# Altium project mdriver2_control.PrjPcb (part 1 of 2)
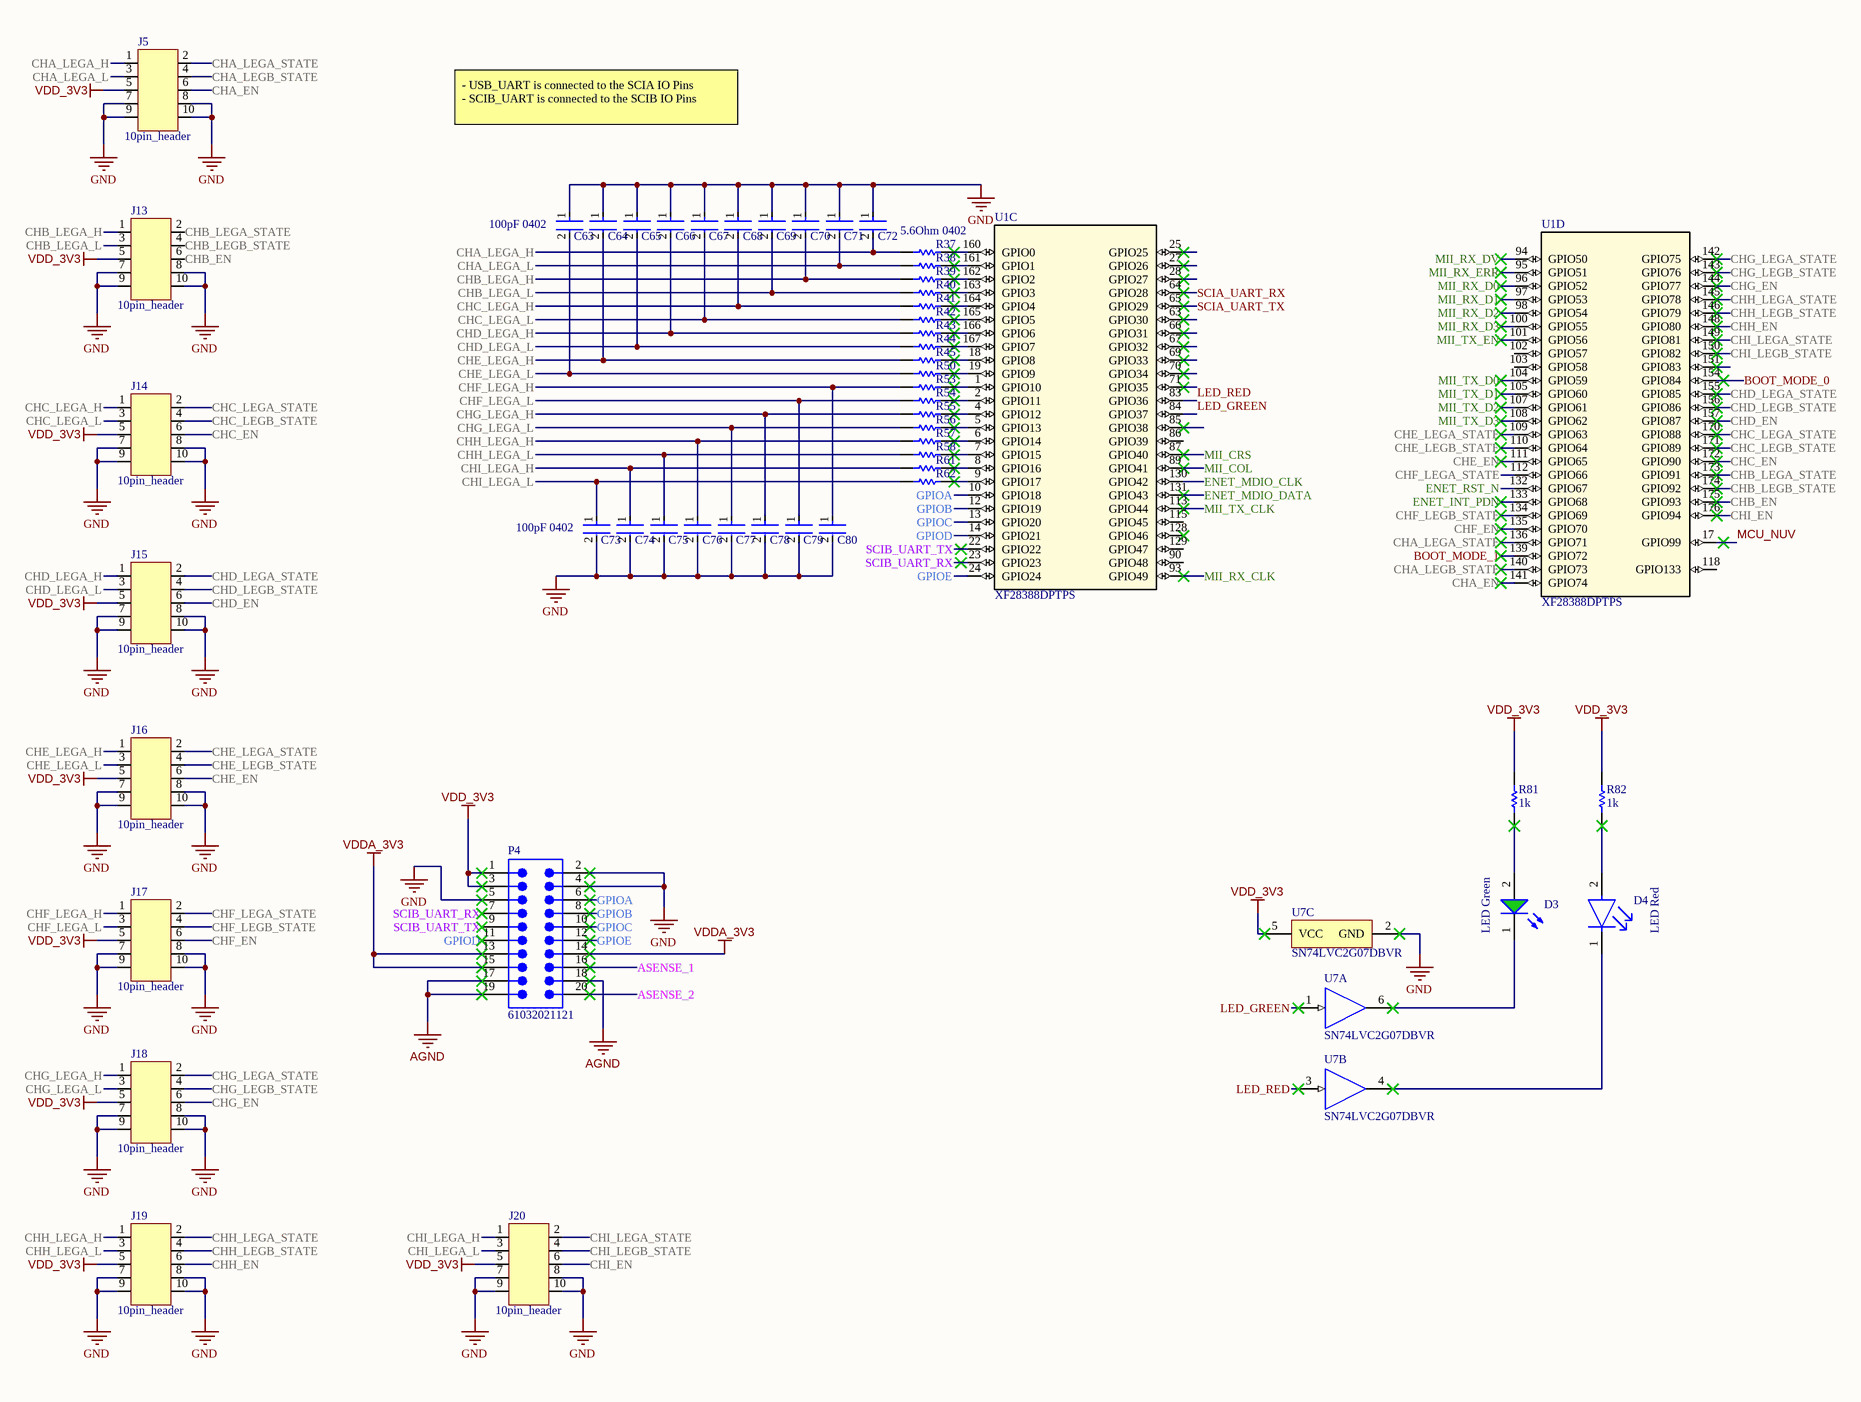
[diagram p0: mcu.SchDoc, right]
6 sheets, 263 parts. Net scope: global (net labels, ports and power ports of the same name join across sheets).
Board file: mdriver2_control.PcbDoc
Sheets:
  mcu.SchDoc
  power.SchDoc
  auxiliary.SchDoc
  usb.SchDoc
  analog.SchDoc
  ethernet.SchDoc

## Sheet mcu.SchDoc
size A3; SheetNumber: 1; SheetTotal: 6

### Parts
C63  100pF 0402  [FP-0402-L_1_0_1-W_0_5_0_1-MFG]
C64  100pF 0402  [FP-0402-L_1_0_1-W_0_5_0_1-MFG]  (value not drawn)
C65  100pF 0402  [FP-0402-L_1_0_1-W_0_5_0_1-MFG]  (value not drawn)
C66  100pF 0402  [FP-0402-L_1_0_1-W_0_5_0_1-MFG]  (value not drawn)
C67  100pF 0402  [FP-0402-L_1_0_1-W_0_5_0_1-MFG]  (value not drawn)
C68  100pF 0402  [FP-0402-L_1_0_1-W_0_5_0_1-MFG]  (value not drawn)
C69  100pF 0402  [FP-0402-L_1_0_1-W_0_5_0_1-MFG]  (value not drawn)
C70  100pF 0402  [FP-0402-L_1_0_1-W_0_5_0_1-MFG]  (value not drawn)
C71  100pF 0402  [FP-0402-L_1_0_1-W_0_5_0_1-MFG]  (value not drawn)
C72  100pF 0402  [FP-0402-L_1_0_1-W_0_5_0_1-MFG]  (value not drawn)
C73  100pF 0402  [FP-0402-L_1_0_1-W_0_5_0_1-MFG]
C74  100pF 0402  [FP-0402-L_1_0_1-W_0_5_0_1-MFG]  (value not drawn)
C75  100pF 0402  [FP-0402-L_1_0_1-W_0_5_0_1-MFG]  (value not drawn)
C76  100pF 0402  [FP-0402-L_1_0_1-W_0_5_0_1-MFG]  (value not drawn)
C77  100pF 0402  [FP-0402-L_1_0_1-W_0_5_0_1-MFG]  (value not drawn)
C78  100pF 0402  [FP-0402-L_1_0_1-W_0_5_0_1-MFG]  (value not drawn)
C79  100pF 0402  [FP-0402-L_1_0_1-W_0_5_0_1-MFG]  (value not drawn)
C80  100pF 0402  [FP-0402-L_1_0_1-W_0_5_0_1-MFG]  (value not drawn)
D3  LED Green  [WL-SMCD_0603]
D4  LED Red  [FP-6_541-5092_01-4-MFG]
J5  10pin_header  [header_10]
J13  10pin_header  [header_10]
J14  10pin_header  [header_10]
J15  10pin_header  [header_10]
J16  10pin_header  [header_10]
J17  10pin_header  [header_10]
J18  10pin_header  [header_10]
J19  10pin_header  [header_10]
J20  10pin_header  [header_10]
P4  61032021121  [61032021121]
R37  5.6Ohm 0402  [RESC1005X40X25NL05T10]
R38  5.6Ohm 0402  [RESC1005X40X25NL05T10]  (value not drawn)
R39  5.6Ohm 0402  [RESC1005X40X25NL05T10]  (value not drawn)
R40  5.6Ohm 0402  [RESC1005X40X25NL05T10]  (value not drawn)
R41  5.6Ohm 0402  [RESC1005X40X25NL05T10]  (value not drawn)
R42  5.6Ohm 0402  [RESC1005X40X25NL05T10]  (value not drawn)
R43  5.6Ohm 0402  [RESC1005X40X25NL05T10]  (value not drawn)
R44  5.6Ohm 0402  [RESC1005X40X25NL05T10]  (value not drawn)
R45  5.6Ohm 0402  [RESC1005X40X25NL05T10]  (value not drawn)
R50  5.6Ohm 0402  [RESC1005X40X25NL05T10]  (value not drawn)
R53  5.6Ohm 0402  [RESC1005X40X25NL05T10]  (value not drawn)
R54  5.6Ohm 0402  [RESC1005X40X25NL05T10]  (value not drawn)
R55  5.6Ohm 0402  [RESC1005X40X25NL05T10]  (value not drawn)
R56  5.6Ohm 0402  [RESC1005X40X25NL05T10]  (value not drawn)
R57  5.6Ohm 0402  [RESC1005X40X25NL05T10]  (value not drawn)
R58  5.6Ohm 0402  [RESC1005X40X25NL05T10]  (value not drawn)
R61  5.6Ohm 0402  [RESC1005X40X25NL05T10]  (value not drawn)
R62  5.6Ohm 0402  [RESC1005X40X25NL05T10]  (value not drawn)
R81  1k  [RES 0402_1005]
R82  1k  [RES 0402_1005]
U1  XF28388DPTPS  [PTP0176F-IPC_A]  (parts C,D of 5)
U7  SN74LVC2G07DBVR  [DBV0006A_M]  (parts A,B,C of 3)

### Nets
AGND: C63.1 C64.1 C65.1 C66.1 C67.1 C68.1 C69.1 C70.1 C71.1 C72.1 C73.2 C74.2 C75.2 C76.2 C77.2 C78.2 C79.2 C80.2 J5.7 J5.8 J5.9 J5.10 J13.7 J13.8 J13.9 J13.10 J14.7 J14.8 J14.9 J14.10 J15.7 J15.8 J15.9 J15.10 J16.7 J16.8 J16.9 J16.10 J17.7 J17.8 J17.9 J17.10 J18.7 J18.8 J18.9 J18.10 J19.7 J19.8 J19.9 J19.10 J20.7 J20.8 J20.9 J20.10 P4.2 P4.4 P4.5 P4.17 P4.18 P4.19 U7.2(GND)  [also labelled GND]
VDD_3V3: J5.5 J13.5 J14.5 J15.5 J16.5 J17.5 J18.5 J19.5 J20.5 P4.1 P4.3 R81.1 R82.1 U7.5(VCC)
VDDA_3V3: P4.13 P4.14 P4.15
ASENSE_1: P4.16
ASENSE_2: P4.20
BOOT_MODE_0: U1.154(GPIO84)
BOOT_MODE_1: U1.139(GPIO72)
CHA_EN: J5.6 U1.141(GPIO74)
CHA_LEGA_H: C72.2 J5.1 R37.1
CHA_LEGA_L: C71.2 J5.3 R38.1
CHA_LEGA_STATE: J5.2 U1.136(GPIO71)
CHA_LEGB_STATE: J5.4 U1.140(GPIO73)
CHB_EN: J13.6 U1.175(GPIO93)
CHB_LEGA_H: C70.2 J13.1 R39.1
CHB_LEGA_L: C69.2 J13.3 R40.1
CHB_LEGA_STATE: J13.2 U1.173(GPIO91)
CHB_LEGB_STATE: J13.4 U1.174(GPIO92)
CHC_EN: J14.6 U1.172(GPIO90)
CHC_LEGA_H: C68.2 J14.1 R41.1
CHC_LEGA_L: C67.2 J14.3 R42.1
CHC_LEGA_STATE: J14.2 U1.170(GPIO88)
CHC_LEGB_STATE: J14.4 U1.171(GPIO89)
CHD_EN: J15.6 U1.157(GPIO87)
CHD_LEGA_H: C66.2 J15.1 R43.1
CHD_LEGA_L: C65.2 J15.3 R44.1
CHD_LEGA_STATE: J15.2 U1.155(GPIO85)
CHD_LEGB_STATE: J15.4 U1.156(GPIO86)
CHE_EN: J16.6 U1.111(GPIO65)
CHE_LEGA_H: C64.2 J16.1 R45.1
CHE_LEGA_L: C63.2 J16.3 R50.1
CHE_LEGA_STATE: J16.2 U1.109(GPIO63)
CHE_LEGB_STATE: J16.4 U1.110(GPIO64)
CHF_EN: J17.6 U1.135(GPIO70)
CHF_LEGA_H: C80.1 J17.1 R53.1
CHF_LEGA_L: C79.1 J17.3 R54.1
CHF_LEGA_STATE: J17.2 U1.112(GPIO66)
CHF_LEGB_STATE: J17.4 U1.134(GPIO69)
CHG_EN: J18.6 U1.144(GPIO77)
CHG_LEGA_H: C78.1 J18.1 R55.1
CHG_LEGA_L: C77.1 J18.3 R56.1
CHG_LEGA_STATE: J18.2 U1.142(GPIO75)
CHG_LEGB_STATE: J18.4 U1.143(GPIO76)
CHH_EN: J19.6 U1.148(GPIO80)
CHH_LEGA_H: C76.1 J19.1 R57.1
CHH_LEGA_L: C75.1 J19.3 R58.1
CHH_LEGA_STATE: J19.2 U1.145(GPIO78)
CHH_LEGB_STATE: J19.4 U1.146(GPIO79)
CHI_EN: J20.6 U1.176(GPIO94)
CHI_LEGA_H: C74.1 J20.1 R61.1
CHI_LEGA_L: C73.1 J20.3 R62.1
CHI_LEGA_STATE: J20.2 U1.149(GPIO81)
CHI_LEGB_STATE: J20.4 U1.150(GPIO82)
ENET_INT_PDN: U1.133(GPIO68)
ENET_MDIO_CLK: U1.130(GPIO42)
ENET_MDIO_DATA: U1.131(GPIO43)
ENET_RST_N: U1.132(GPIO67)
GPIOA: P4.6 U1.10(GPIO18)
GPIOB: P4.8 U1.12(GPIO19)
GPIOC: P4.10 U1.13(GPIO20)
GPIOD: P4.11 U1.14(GPIO21)
GPIOE: P4.12 U1.24(GPIO24)
LED_GREEN: U1.84(GPIO37) U7.1(1A)
LED_RED: U1.83(GPIO36) U7.3(2A)
MCU_NUV: U1.17(GPIO99)
MII_COL: U1.89(GPIO41)
MII_CRS: U1.87(GPIO40)
MII_RX_CLK: U1.93(GPIO49)
MII_RX_D0: U1.96(GPIO52)
MII_RX_D1: U1.97(GPIO53)
MII_RX_D2: U1.98(GPIO54)
MII_RX_D3: U1.100(GPIO55)
MII_RX_DV: U1.94(GPIO50)
MII_RX_ERR: U1.95(GPIO51)
MII_TX_CLK: U1.113(GPIO44)
MII_TX_D0: U1.104(GPIO59)
MII_TX_D1: U1.105(GPIO60)
MII_TX_D2: U1.107(GPIO61)
MII_TX_D3: U1.108(GPIO62)
MII_TX_EN: U1.101(GPIO56)
SCIA_UART_RX: U1.64(GPIO28)
SCIA_UART_TX: U1.65(GPIO29)
SCIB_UART_RX: P4.7 U1.23(GPIO23)
SCIB_UART_TX: P4.9 U1.22(GPIO22)
NetD3_1: D3.1(K) U7.6(1Y)
NetD3_2: D3.2(A) R81.2
NetD4_1: D4.1(C) U7.4(2Y)
NetD4_2: D4.2(A) R82.2
NetR37_2: R37.2 U1.160(GPIO0)
NetR38_2: R38.2 U1.161(GPIO1)
NetR39_2: R39.2 U1.162(GPIO2)
NetR40_2: R40.2 U1.163(GPIO3)
NetR41_2: R41.2 U1.164(GPIO4)
NetR42_2: R42.2 U1.165(GPIO5)
NetR43_2: R43.2 U1.166(GPIO6)
NetR44_2: R44.2 U1.167(GPIO7)
NetR45_2: R45.2 U1.18(GPIO8)
NetR50_2: R50.2 U1.19(GPIO9)
NetR53_2: R53.2 U1.1(GPIO10)
NetR54_2: R54.2 U1.2(GPIO11)
NetR55_2: R55.2 U1.4(GPIO12)
NetR56_2: R56.2 U1.5(GPIO13)
NetR57_2: R57.2 U1.6(GPIO14)
NetR58_2: R58.2 U1.7(GPIO15)
NetR61_2: R61.2 U1.8(GPIO16)
NetR62_2: R62.2 U1.9(GPIO17)

Not connected (* = marked no-connect by the designer): U1 25(GPIO25)* 27(GPIO26)* 28(GPIO27)* 63(GPIO30)* 66(GPIO31)* 67(GPIO32)* 69(GPIO33)* 70(GPIO34)* 71(GPIO35)* 85(GPIO38)* 86(GPIO39) 90(GPIO48) 102(GPIO57) 103(GPIO58) 115(GPIO45) 118(GPIO133) 128(GPIO46)* 129(GPIO47) 151(GPIO83)*

### Notes on the sheet
- - USB_UART is connected to the SCIA IO Pins
  - SCIB_UART is connected to the SCIB IO Pins

### Library data of the parts
C63-C80 = b4654b650e69147ec39a6b967a45e02: MLCC 0402 100pF; Voltage: 50V; Tolerance: 5%; Dielectric: C0G; Insulation Resistance: 1GR; Dissipation Factor: 2.5%; Temperature Coefficient: 30ppm/°C; REACH SVHC: No SVHC; Termination: SMD/SMT; Construction: Flat; Contact Plating: Tin; Width: 0.02inch; Series: -; Voltage Rating (DC): 50V; Voltage Rating: 50V; Height: 0.56mm; Max Operating Temperature: 125°C; Length: 1mm; Lead Free: Lead Free; Case/Package: 0402; Min Operating Temperature: -55°C; Depth: 0.5mm; Case Code (Metric): 1005; Thickness: 0.022inch; Radiation Hardening: No; Case Code (Imperial): 0402; Mount: Surface Mount; Capacitance: 100pF; Packaging: Tape and Reel; Package Quantity: 1; RoHS Compliant: Yes
D3 = CMP-03913-90235563-2: 150060GS55040 WL-SMCD SMT Mono-color Chip LED Diffused; Forward Voltage: 3.2V; Forward Current: 60mA; Luminous Intensity: 430mcd; Peak Wavelength: 520nm; Viewing Angle: 140°; Wavelength: 525nm; Max Reverse Voltage (DC): 5V; Max Operating Temperature: 85°C; Length: 1.6mm; Height: 400µm; Packaging: Tape and Reel; NexarPartId: 90235563; Dominant Wavelength: 525nm; Min Operating Temperature: -40°C; RoHS: Compliant; Width: 800µm
D4 = CMP-02520-000012-1: LED RED 0603 SMD; Manufacturer: Vishay; Manufacturer Part Number: VLMS1300-GS08; Forward Voltage: 2V; Reverse Voltage: 5V; Power Dissipation: 75mW; Forward Current: 20mA; Luminous Intensity: 54mcd; Led Orientation: Top View; Peak Emmision Wavelength: 639nm; Viewing Angle: 130°; Wavelength: 631nm; Digikey Description: LED RED 0603 SMD; Height: 1mm; Colour: Red; Ambient Temperature Range High: +85°C; Ambient Temperature Range Low: -35°C; Package: 6.541-5092.01-4; Automotive: No; Temperature Range High: +85°C; Device Class L3: unset; Lead Free: Yes; Temperature Range Low: -35°C; Temperature: -35°C to +85°C; Device Class L2: LEDs; ComponentLink2Description: Datasheet; Octopart: https://octopart.com/vlms1300-gs08-vishay-21709201; Device Class L1: Optoelectronics; RoHS: TRUE; ComponentLink2URL: http://www.vishay.com/docs/82437/vlmo1300.pdf; Mouser Description: Standard LEDs - SMD Super Red Clear Non-Diff; Category: Diode
J5 J13-J20 = 10pin_header: Pin header male 2x5 2.54mm; Supplier 1: Digikey; Supplier Part Number 1: 1175-1754-ND
P4 = Header_Male_2R_20P: Pin header SMD 10x2; NexarPartId: 32855455; Gender: Male; Number of Contacts: 20; Contact Resistance: 20mΩ; Row Spacing: 2.54mm; Operating Supply Voltage: 250V; Current Rating: 3A; Connector Type: Male Pin; Packaging: Tape and Reel; Contact Material: Copper; RoHS: Compliant; Orientation: Vertical; Contact Mating Length: 5.9944mm; REACH SVHC: Unknown; Number of Rows: 2; Number of Pins: 20; Number of Positions: 20; Termination: Solder; Mount: Surface Mount; Lead Pitch: 2.54mm; Contact Plating: Gold; Color: Black; Pitch: 2.54mm
R37-R45 R50 R53-R58 R61 R62 = RES: Resistor 5.6Ohm 0402; Manufacturer: Yageo / Phycomp; Part Number: RC0402FR-075R6L
R81 R82 = Res1: Resistor 1kOhm 0402 1%; Published: 8-Jun-2000; LatestRevisionDate: 17-Jul-2002; LatestRevisionNote: Re-released for DXP Platform.; PackageReference: AXIAL-0.3; Publisher: Altium Limited; PackageDescription: Axial Device, Thru-Hole; 2 Leads; 0.3 in Pin Spacing; Value: 1k; Supplier 1: Mouser; Supplier Part Number 1: 71-CRCW0402-1.0K-E3
U1 = XF28388DPTPS: Mfr_Name: Texas Instruments; TYPE: TYPE; RefDes: RefDes
U7 = CMP-0859-00195-3: Dual Buffer/Driver with Open-Drain Output, DBV0006A, LARGE T&R; Manufacturer: Texas Instruments; Technology Family: LVC; Output Type: CMOS; 3-State Output: No; Output Drive (IOL/IOH)(Max)(mA): 32/-32; Bits(#): 2; Sub-Family: Inverting Buffer/Driver; ICC @ Nom Voltage(Max)(mA): 0.01; F @ Nom Voltage(Max)(Mhz): 150; VCC(Min)(V): 1.65; VCC(Max)(V): 5.5; Voltage(Nom)(V): 1.8,2.5,3.3,5; Input Type: CMOS/TTL; tpd @ Nom Voltage(Max)(ns): 8.6,4.4,3.7,2.9; Rating: Catalog; Logic: True; Generic Part Number: SN74LVC2G07; Operating Temperature Range(C): -40 to 125; Schmitt Trigger: No; PackageReference: DBV0006A; DatasheetVersion: SCES308K

## Sheet power.SchDoc
size A3; SheetNumber: 2; SheetTotal: 6; SPICEModelCachePMSURHYN: <root> / <DocumentId>PMSURHYN</DocumentId> / <CacheFrame Number="0"> / <Model Name="bkp2125_hs600-t" Kind="CKT"> / <Text>* BKP2125_HS600-T     SPICE MODEL  ( General Type ) / *-------------------------------------------------------------------------------------------------------- / * Model Generated by TAIYO YUDEN Corporation (http://www.ty-top.com) / * Version 2.0 / * TAIYO YUDEN Control No. 070822 / * Copyright(c) 2007 TAIYO YUDEN CO.,LTD. All Rights Reserved. / *-------------------------------------------------------------------------------------------------------- / * / * Products Name : Ferrite Bead Inductors / * / * Characteristics : / *     Impedance at 100MHz : 60 Ohm , DC Resistance(max) : 0.025 Ohm , Rated Current : 3000 mA , / *     Case Size : 2.0 x 1.25 / 0.079 x 0.049 [mm/inch] , Thickness : 0.85 / 0.033 [mm/inch] / *     (Conditions: Temperature = 25 degC , DC Bias Current/Voltage = 0A / 0V) / * / * External Node Assignments : / * / *  1  o---GGG---o  2 / * / *-------------------------------------------------------------------------------------------------------- / .SubCkt BKP2125_HS600-T 1 2 / **************************** / R1 1 7 0.012 / R2 7 2 74 / C1 7 2 1.4p / L0 7 3 0.168u / L1 3 2 0.392u / L3 3 5 0.168u / R3 5 2 74 / **************************** / .ends BKP2125_HS600-T</Text> / </Model> / </CacheFrame> / </root>
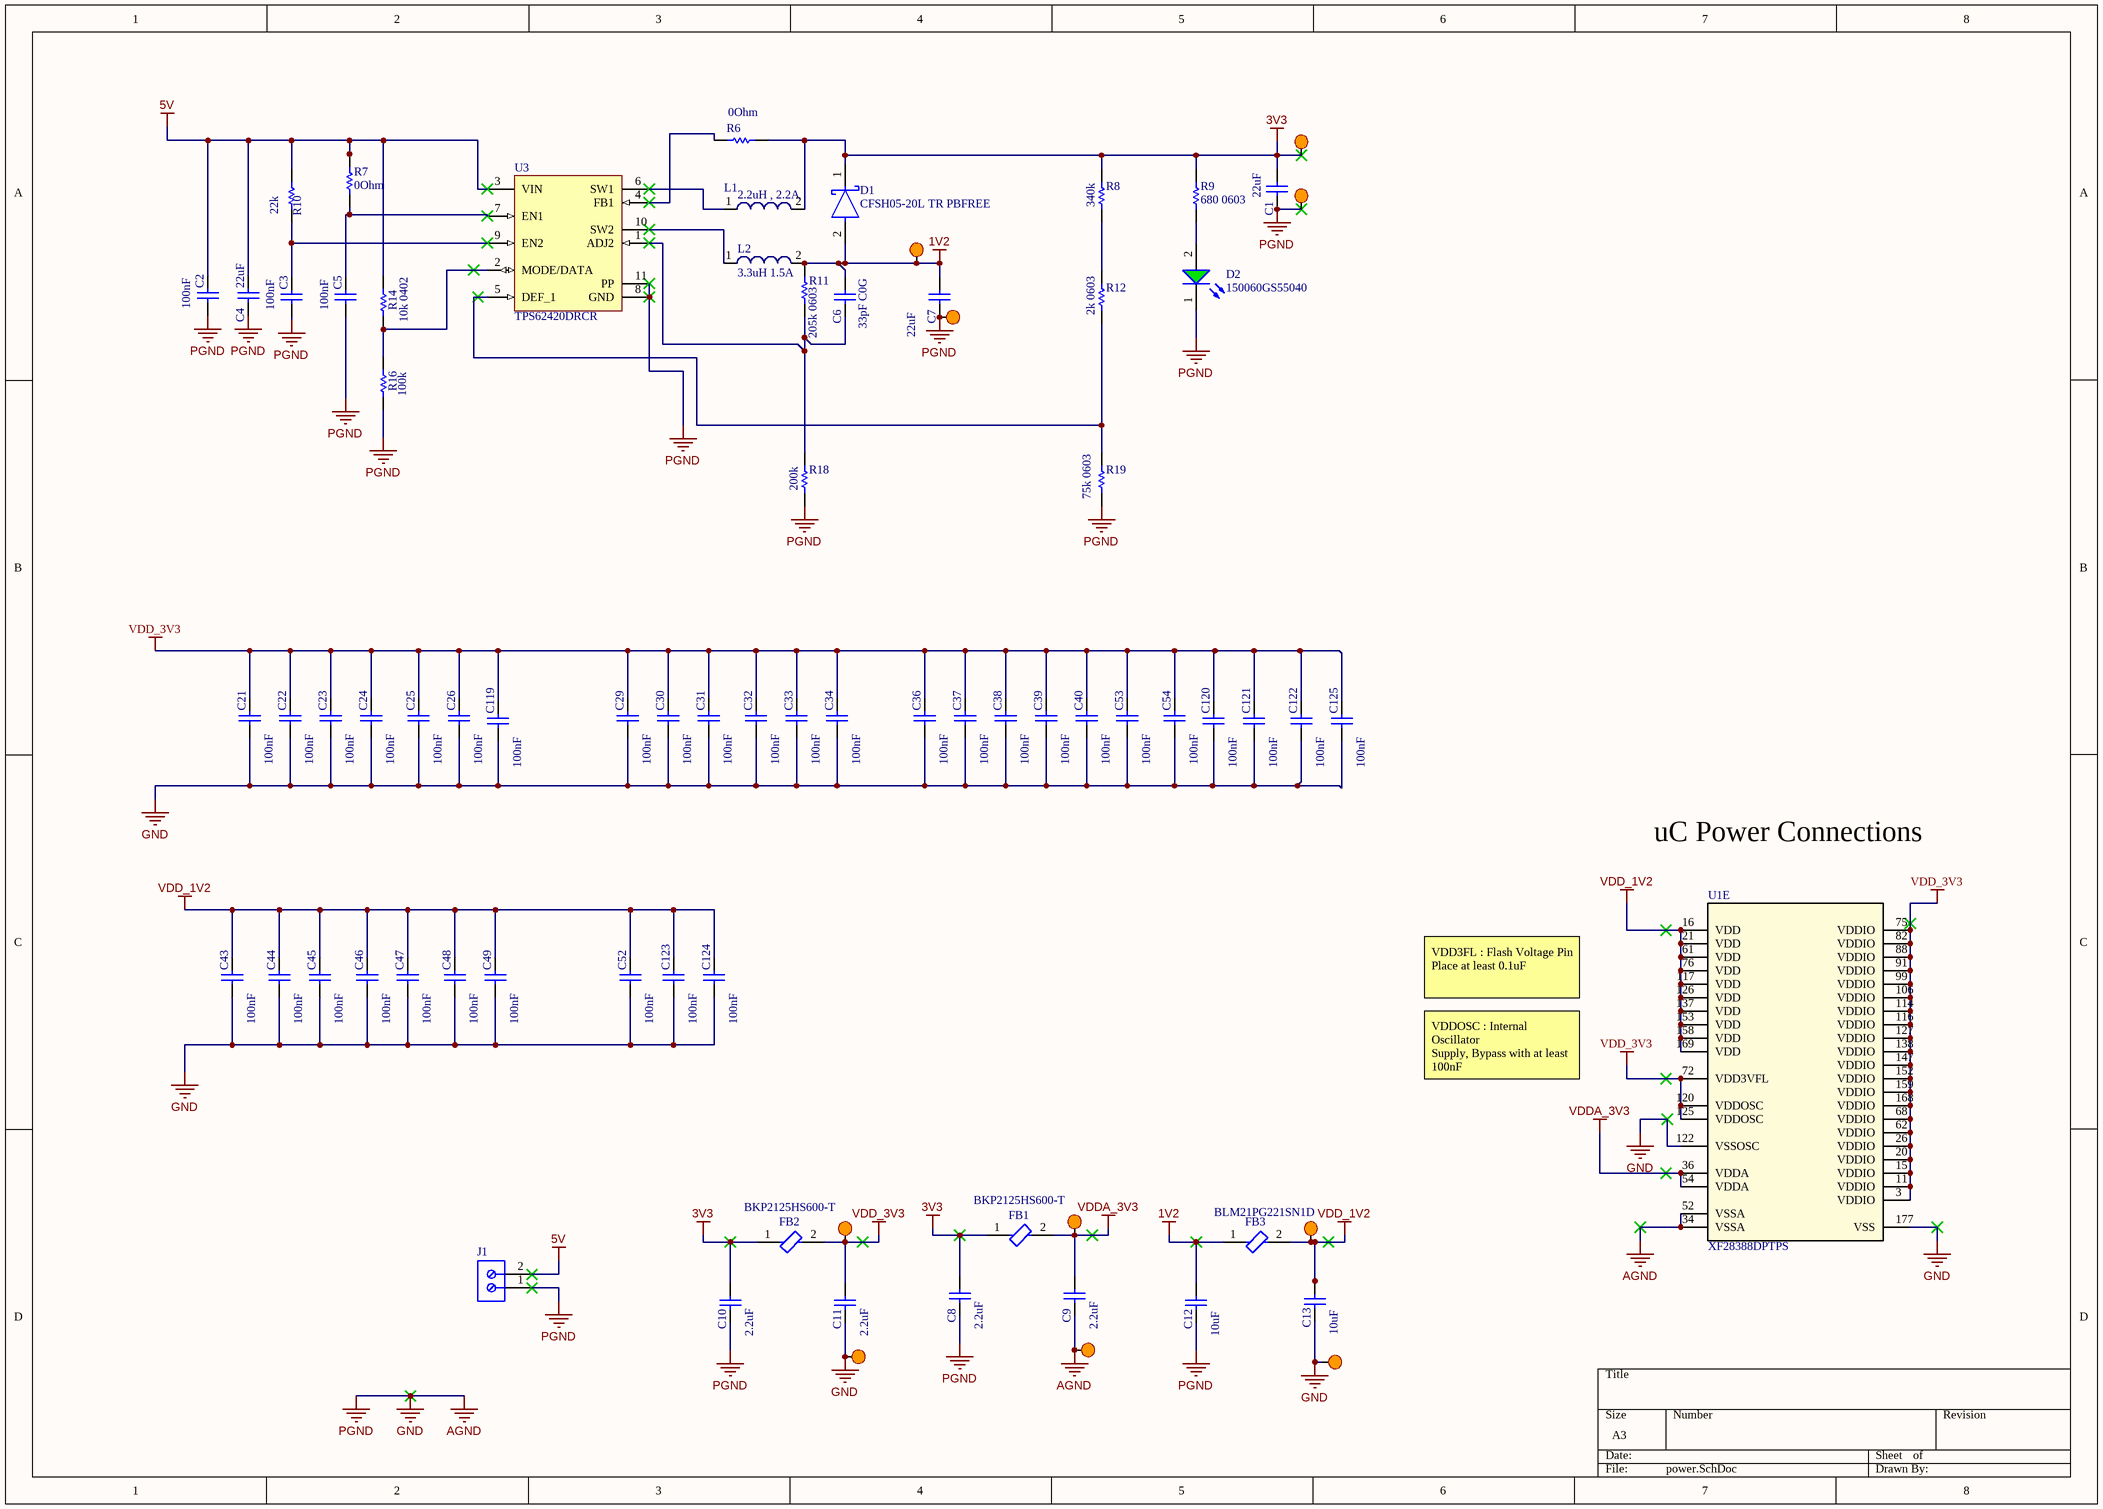
[diagram p1: power.SchDoc]

### Parts
C1  22uF  [CAP 0805_2012]
C2  100nF  [CAP 0402_1005]
C3  100nF  [CAP 0402_1005]
C4  22uF  [CAP 0805_2012]
C5  100nF  [CAP 0402_1005]
C6  33pF C0G  [CAP 0603_1608]
C7  22uF  [CAP 0805_2012]
C8  2.2uF  [CAP 0603_1608]
C9  2.2uF  [CAP 0603_1608]
C10  2.2uF  [CAP 0603_1608]
C11  2.2uF  [CAP 0603_1608]
C12  10uF  [CAP 0805_2012]
C13  10uF  [CAP 0805_2012]
C21  100nF  [CAP 0402_1005]
C22  100nF  [CAP 0402_1005]
C23  100nF  [CAP 0402_1005]
C24  100nF  [CAP 0402_1005]
C25  100nF  [CAP 0402_1005]
C26  100nF  [CAP 0402_1005]
C29  100nF  [CAP 0402_1005]
C30  100nF  [CAP 0402_1005]
C31  100nF  [CAP 0402_1005]
C32  100nF  [CAP 0402_1005]
C33  100nF  [CAP 0402_1005]
C34  100nF  [CAP 0402_1005]
C36  100nF  [CAP 0402_1005]
C37  100nF  [CAP 0402_1005]
C38  100nF  [CAP 0402_1005]
C39  100nF  [CAP 0402_1005]
C40  100nF  [CAP 0402_1005]
C43  100nF  [CAP 0402_1005]
C44  100nF  [CAP 0402_1005]
C45  100nF  [CAP 0402_1005]
C46  100nF  [CAP 0402_1005]
C47  100nF  [CAP 0402_1005]
C48  100nF  [CAP 0402_1005]
C49  100nF  [CAP 0402_1005]
C52  100nF  [CAP 0402_1005]
C53  100nF  [CAP 0402_1005]
C54  100nF  [CAP 0402_1005]
C119  100nF  [CAP 0402_1005]
C120  100nF  [CAP 0402_1005]
C121  100nF  [CAP 0402_1005]
C122  100nF  [CAP 0402_1005]
C123  100nF  [CAP 0402_1005]
C124  100nF  [CAP 0402_1005]
C125  100nF  [CAP 0402_1005]
D1  CFSH05-20L TR PBFREE  [FP-SOD-882L-MFG]
D2  150060GS55040  [WL-SMCD_0603]
FB1  BKP2125HS600-T  [FP-BKP2125-MFG]
FB2  BKP2125HS600-T  [FP-BKP2125-MFG]
FB3  BLM21PG221SN1D  [FP-BLM21-0_2-t0_85-e0_5-IPC_B]
J1  691709710302  [691709710302]  (value not drawn)
L1  2.2uH , 2.2A  [WE-LQS 4018]
L2  3.3uH 1.5A  [WE-LQS 3015]
R6  0Ohm  [RES 0603_1608]
R7  0Ohm  [RES 0603_1608]
R8  340k  [RES 0603_1608]
R9  680 0603  [RES 0603_1608]
R10  22k  [RES 0603_1608]
R11  205k 0603  [RES 0603_1608]
R12  2k 0603  [RES 0603_1608]
R14  10k 0402  [RES 0402_1005]
R16  100k  [RES 0402_1005]
R18  200k  [RES 0603_1608]
R19  75k 0603  [RES 0603_1608]
TP1  TP?  [testpoint]  (value not drawn)
TP2  TP?  [testpoint]  (value not drawn)
TP3  TP?  [testpoint]  (value not drawn)
TP4  TP?  [testpoint]  (value not drawn)
TP8  TP?  [testpoint]  (value not drawn)
TP9  TP?  [testpoint]  (value not drawn)
TP10  TP?  [testpoint]  (value not drawn)
TP11  TP?  [testpoint]  (value not drawn)
TP12  TP?  [testpoint]  (value not drawn)
TP13  TP?  [testpoint]  (value not drawn)
U1  XF28388DPTPS  [PTP0176F-IPC_A]  (part E of 5)
U3  TPS62420DRCR  [DRC0010J_V]

### Nets
1V2: C6.2 C7.2 C12.2 D1.2(A) FB3.1 L2.2 R11.2 TP4.1
3V3: C1.2 C8.2 C10.2 D1.1(C) FB1.1 FB2.1 L1.2 R6.2 R8.2 R9.2 TP1.1
5V: C2.2 C4.2 J1.2 R7.1 R10.2 R14.2 U3.3(VIN)
AGND: C1.1 C2.1 C3.1 C4.1 C5.1 C7.1 C8.1 C9.1 C10.1 C11.1 C12.1 C13.1 C21.1 C22.1 C23.1 C24.1 C25.1 C26.1 C29.1 C30.1 C31.1 C32.1 C33.1 C34.1 C36.1 C37.1 C38.1 C39.1 C40.1 C43.1 C44.1 C45.1 C46.1 C47.1 C48.1 C49.1 C52.1 C53.1 C54.1 C119.1 C120.1 C121.1 C122.1 C123.1 C124.1 C125.1 D2.1(K) J1.1 R16.1 R18.1 R19.1 TP2.1 TP3.1 TP11.1 TP12.1 TP13.1 U1.34(VSSA) U1.52(VSSA) U1.122(VSSOSC) U1.177(VSS) U3.8(GND) U3.11(PP)  [also labelled GND, PGND]
VDD_1V2: C13.2 C43.2 C44.2 C45.2 C46.2 C47.2 C48.2 C49.2 C52.2 C123.2 C124.2 FB3.2 TP10.1 U1.16(VDD) U1.21(VDD) U1.61(VDD) U1.76(VDD) U1.117(VDD) U1.126(VDD) U1.137(VDD) U1.153(VDD) U1.158(VDD) U1.169(VDD)
VDD_3V3: C11.2 C21.2 C22.2 C23.2 C24.2 C25.2 C26.2 C29.2 C30.2 C31.2 C32.2 C33.2 C34.2 C36.2 C37.2 C38.2 C39.2 C40.2 C53.2 C54.2 C119.2 C120.2 C121.2 C122.2 C125.2 FB2.2 TP9.1 U1.3(VDDIO) U1.11(VDDIO) U1.15(VDDIO) U1.20(VDDIO) U1.26(VDDIO) U1.62(VDDIO) U1.68(VDDIO) U1.72(VDD3VFL) U1.75(VDDIO) U1.82(VDDIO) U1.88(VDDIO) U1.91(VDDIO) U1.99(VDDIO) U1.106(VDDIO) U1.114(VDDIO) U1.116(VDDIO) U1.120(VDDOSC) U1.125(VDDOSC) U1.127(VDDIO) U1.138(VDDIO) U1.147(VDDIO) U1.152(VDDIO) U1.159(VDDIO) U1.168(VDDIO)
VDDA_3V3: C9.2 FB1.2 TP8.1 U1.36(VDDA) U1.54(VDDA)
NetC3_2: C3.2 R10.1 U3.9(EN2)
NetC5_2: C5.2 R7.2 U3.7(EN1)
NetC6_1: C6.1 R11.1 R18.2 U3.1(ADJ2)
NetD2_2: D2.2(A) R9.1
NetL1_1: L1.1 U3.6(SW1)
NetL2_1: L2.1 U3.10(SW2)
NetR6_1: R6.1 U3.4(FB1)
NetR8_1: R8.1 R12.2
NetR12_1: R12.1 R19.2 U3.5(DEF_1)
NetR14_1: R14.1 R16.2 U3.2(MODE/DATA)

### Notes on the sheet
- uC Power Connections
- VDD3FL : Flash Voltage Pin
  Place at least 0.1uF
- VDDOSC : Internal Oscillator
  Supply, Bypass with at least 100nF

### Library data of the parts
C1 C4 C7 = Cap: MLCC 22uF 0805 5V; Published: 8-Jun-2000; LatestRevisionDate: 17-Jul-2002; LatestRevisionNote: Re-released for DXP Platform.; PackageReference: RAD-0.3; Publisher: Altium Limited; PackageDescription: Radial Cap, Thru-Hole; 2 Leads; 0.3 in Pin Spacing; Value: 22uF
C2 C3 C5 C21-C26 C29-C34 C36-C40 C43-C49 C52-C54 C119-C125 = Cap: MLCC 100nF 0402 10V; Published: 8-Jun-2000; LatestRevisionDate: 17-Jul-2002; LatestRevisionNote: Re-released for DXP Platform.; PackageReference: RAD-0.3; Publisher: Altium Limited; PackageDescription: Radial Cap, Thru-Hole; 2 Leads; 0.3 in Pin Spacing; Value: 100nF; Supplier 1: Arrow Electronics; Supplier Part Number 1: C0402C104K8PACTU
C6 = Cap: MLCC 33pF 0603 10V C0G; Published: 8-Jun-2000; LatestRevisionDate: 17-Jul-2002; LatestRevisionNote: Re-released for DXP Platform.; PackageReference: RAD-0.3; Publisher: Altium Limited; PackageDescription: Radial Cap, Thru-Hole; 2 Leads; 0.3 in Pin Spacing; Value: 33pF
C8-C11 = Cap: MLCC 2.2uF 0603 10V; Published: 8-Jun-2000; LatestRevisionDate: 17-Jul-2002; LatestRevisionNote: Re-released for DXP Platform.; PackageReference: RAD-0.3; Publisher: Altium Limited; PackageDescription: Radial Cap, Thru-Hole; 2 Leads; 0.3 in Pin Spacing; Value: 2.2uF
C12 C13 = Cap: MLCC 10uF 0805 10V; Published: 8-Jun-2000; LatestRevisionDate: 17-Jul-2002; LatestRevisionNote: Re-released for DXP Platform.; PackageReference: RAD-0.3; Publisher: Altium Limited; PackageDescription: Radial Cap, Thru-Hole; 2 Leads; 0.3 in Pin Spacing; Value: 10uF; Supplier 1: Mouser; Supplier Part Number 1: 80-C0805C106K8P
D1 = CMP-00647-58683154-1: CFSH05-20L TR PBFREE Rectifier Diode, Schottky, 1 Phase, 1 Element, 0.1A, 30V V(RRM); Schedule B: 8541100070, 8541100070; NexarPartId: 58683154; RoHS: Non-Compliant
D2 = CMP-03913-90235563-2: as D3 on sheet mcu; Max Operating Temperature: 85°C; Length: 1.6mm; Height: 400µm; Packaging: Tape and Reel; NexarPartId: 90235563; Dominant Wavelength: 525nm; Min Operating Temperature: -40°C; RoHS: Compliant; Width: 800µm
FB1 FB2 = CMP-14488-000008-2: 60 Ohms @ 100 MHz 1 Power, Signal Line Ferrite Bead 0805 (2012 Metric) 5A 20mOhm; Max DC Current: 3A; Tolerance: 25%; Number of Lines: 1; DC Resistance (DCR): 25mR; Impedance: 60R; Test Frequency: 100MHz; Shielding: Unshielded; Packaging: Tape and Reel; Case Code (Imperial): 0805; Series: BK; Package Quantity: 1; Lead Free: Lead Free; Number of Pins: 2; Max Current Rating: 3A; Length: 2.3mm; Case/Package: 0805; Max Operating Temperature: 85°C; Min Operating Temperature: -55°C; Core Material: Ferrite; Case Code (Metric): 2125; Depth: 1.45mm; Resistance: 25mR; Halogen Free: Halogen Free; Termination: SMD/SMT; Width: 0.049inch; RoHS Compliant: Yes; Mount: Surface Mount; Height: 1.05mm
FB3 = CMP-0686-00610-3: Chip Ferrite Bead, 0805, 220Ω @ 100MHz, 0.045Ω, 25%, 2A; Number of Circuits: 1; Shielding: Unshielded; DC Resistance (DCR): 45mR; Impedance: 220R; Radiation Hardening: No; Material: Ferrite; Frequency: 100MHz; Width: 1.25mm; DC Current: 2A; Max DC Current: 2A; Number of Lines: 1; Package Quantity: 1; Case Code (Metric): 2012; Current Rating: 2A; Case/Package: 0805; Current: 2A; Military Standard: Not; Core Material: Ferrite; Depth: 1.25mm; Contact Plating: Tin; DC Resistance-Max: 45mR; Max Operating Temperature: 125°C; Length: 2mm; Max Current Rating: 2A; REACH SVHC: No SVHC; Termination: SMD/SMT; Min Operating Temperature: -55°C; Series: BLM21P; Test Frequency: 100MHz; Tolerance: 25%; Number of Pins: 2; RoHS Compliant: Yes; Height: 0.85mm; Packaging: Tape and Reel; Lead Free: Lead Free; Case Code (Imperial): 0805
J1 = CMP-1502-03335-2: SMD Terminal Block 6A; NexarPartId: 34186867; Number of Positions: 2; Number of Levels: 1; Pitch: 5mm; Wire Gauge (Min): 14AWG; Wire Gauge (Max): 30AWG; Connector Type: Screw; Voltage: 300V; Plating: Steel; Housing Material: Nylon; Lead Pitch: 5mm; Current Rating: 6A; REACH SVHC: Unknown; Flammability Rating: UL94 V-0; Height: 11.1mm; Termination: Screw; Current: 6A; Contact Plating: Tin; Number of Rows: 1; Max Operating Temperature: 130°C; Color: Black; Mount: Surface Mount; Voltage Rating: 300V; Min Operating Temperature: -40°C; Contact Material: Tin; Wire/Cable Gauge: 30AWG; Packaging: Digi-Reel®; Length: 10mm; Number of Pins: 2; RoHS: Compliant; Number of Contacts: 2; Number of Positions Per Level: 2; Supplier 1: Digikey; Supplier Part Number 1: 1297-1108-1-ND
L1 = CMP-1354-00032-1: WE-LQS SMD Power Inductor, L=2.2 µH; PartNumber: 74404042022; Manufacturer: Wuerth Elektronik; Inductance: 2.2 ÂµH; ComponentLink1Description: Manufacturer URL; PackageReference: WE-LQS 4018; ComponentLink2URL: http://katalog.we-online.de/pbs/datasheet/74404042022.pdf; ComponentLink2Description: Datasheet; ComponentLink1URL: http://www.we-online.com
L2 = CMP-1354-00021-1: WE-LQS SMD Power Inductor, L=3.3 µH; PartNumber: 74404032033; Manufacturer: Wuerth Elektronik; Inductance: 3.3 ÂµH; ComponentLink2Description: Datasheet; ComponentLink2URL: http://katalog.we-online.de/pbs/datasheet/74404032033.pdf; ComponentLink1Description: Manufacturer URL; ComponentLink1URL: http://www.we-online.com; PackageReference: WE-LQS 3015
R6 R7 = Res1: Resistor 0Ohm 0603; Value: 22k; Published: 8-Jun-2000; LatestRevisionDate: 17-Jul-2002; LatestRevisionNote: Re-released for DXP Platform.; PackageReference: AXIAL-0.3; Publisher: Altium Limited; PackageDescription: Axial Device, Thru-Hole; 2 Leads; 0.3 in Pin Spacing; Supplier 1: Future Electronics; Supplier Part Number 1: 3375797
R8 = Res1: Resistor 340kOhm 0603; Published: 8-Jun-2000; LatestRevisionDate: 17-Jul-2002; LatestRevisionNote: Re-released for DXP Platform.; PackageReference: AXIAL-0.3; Publisher: Altium Limited; PackageDescription: Axial Device, Thru-Hole; 2 Leads; 0.3 in Pin Spacing; Value: 340k; Supplier 1: Digikey; Supplier Part Number 1: 1712-CPF0603B340KE1CT-ND
R9 = Res1: Resistor 680Ohm 0603; Value: 680; Published: 8-Jun-2000; LatestRevisionDate: 17-Jul-2002; LatestRevisionNote: Re-released for DXP Platform.; PackageReference: AXIAL-0.3; Publisher: Altium Limited; PackageDescription: Axial Device, Thru-Hole; 2 Leads; 0.3 in Pin Spacing
R10 = Res1: Resistor 22kOhm 0603; Published: 8-Jun-2000; LatestRevisionDate: 17-Jul-2002; LatestRevisionNote: Re-released for DXP Platform.; PackageReference: AXIAL-0.3; Publisher: Altium Limited; PackageDescription: Axial Device, Thru-Hole; 2 Leads; 0.3 in Pin Spacing; Value: 22k; Supplier 1: Future Electronics; Supplier Part Number 1: 1933787
R11 = Res1: Resistor 205kOhm 0603; Published: 8-Jun-2000; LatestRevisionDate: 17-Jul-2002; LatestRevisionNote: Re-released for DXP Platform.; PackageReference: AXIAL-0.3; Publisher: Altium Limited; PackageDescription: Axial Device, Thru-Hole; 2 Leads; 0.3 in Pin Spacing; Value: 205k
R12 = Res1: Resistor 2kOhm 0603; Published: 8-Jun-2000; LatestRevisionDate: 17-Jul-2002; LatestRevisionNote: Re-released for DXP Platform.; PackageReference: AXIAL-0.3; Publisher: Altium Limited; PackageDescription: Axial Device, Thru-Hole; 2 Leads; 0.3 in Pin Spacing; Value: 2k
R14 = Res1: Resistor 10kOhm 0402; Published: 8-Jun-2000; LatestRevisionDate: 17-Jul-2002; LatestRevisionNote: Re-released for DXP Platform.; PackageReference: AXIAL-0.3; Publisher: Altium Limited; PackageDescription: Axial Device, Thru-Hole; 2 Leads; 0.3 in Pin Spacing; Value: 10k
R16 = Res1: Resistor 100kOhm 0402; Value: 10k; Published: 8-Jun-2000; LatestRevisionDate: 17-Jul-2002; LatestRevisionNote: Re-released for DXP Platform.; PackageReference: AXIAL-0.3; Publisher: Altium Limited; PackageDescription: Axial Device, Thru-Hole; 2 Leads; 0.3 in Pin Spacing
R18 = Res1: Resistor 200kOhm 0603; Published: 8-Jun-2000; LatestRevisionDate: 17-Jul-2002; LatestRevisionNote: Re-released for DXP Platform.; PackageReference: AXIAL-0.3; Publisher: Altium Limited; PackageDescription: Axial Device, Thru-Hole; 2 Leads; 0.3 in Pin Spacing; Value: 200k; Supplier: Arrow Electronics; Supplier Part Number: GRM155R71C104KA88D
R19 = Res1: Resistor 75kOhm 0603; Published: 8-Jun-2000; LatestRevisionDate: 17-Jul-2002; LatestRevisionNote: Re-released for DXP Platform.; PackageReference: AXIAL-0.3; Publisher: Altium Limited; PackageDescription: Axial Device, Thru-Hole; 2 Leads; 0.3 in Pin Spacing; Value: 75k
TP1-TP4 TP8-TP13 = testpoint
U1 = XF28388DPTPS: Mfr_Name: Texas Instruments; TYPE: TYPE; RefDes: RefDes
U3 = CMP-0323-00293-3: Buck Adjustable Regulator with 2.5 to 6 V Input and 0.6 to 6 V Output, -40 to 85 degC, 10-Pin SON (DRC), Green (RoHS & no Sb/Br); Manufacturer: Texas Instruments; Iout2(Max)(A): 1; Vout(Min)(V): 0.6; Vin(Min)(V): 2.5; SubFamily: Step-Down Regulator; Regulated Outputs(#): 2; Dynamic Voltage Scaling: TRUE; Iq(Typ)(mA): 0.032; Vout(Max)(V): 6; Rating: Catalog; Duty Cycle(Max)(%): 100; ComponentLink2URL: http://www.ti.com/litv/pdf/mpds117k; ComponentLink1URL: http://www.ti.com/general/docs/lit/getliterature.tsp?genericPartNumber=TPS62420&fileType=pdf; Switch Current Limit(Typ)(A): 1; PartNumber: TPS62420DRCR; ComponentLink2Description: Package Specification; Topology: Buck; Mounting Technology: Surface Mount; PackageVersion: revL, Sep-2011; ComponentLink1Description: Datasheet; Iout(Max)(A): 0.6; PackageDescription: 10-Pin Plastic Small Outline No-Lead, 3 x 3 x 1 mm Body, 0.5 mm Pitch, Exposed Pad; ComponentLink3URL: Samples URL:http://www.ti.com/product/tps62420#samples; Eco-Plan: Green (RoHS & no Sb/Br); ComponentLink3Description: URL Link1; PackageReference: DRC0010J; Vout2(Max)(V): 6; DatasheetVersion: SLVS676C; Synchronous Rectification: TRUE; Vin(Max)(V): 6; Vout2(Min)(V): 0.6

## Sheet auxiliary.SchDoc
size A3; SheetNumber: 3; SheetTotal: 6
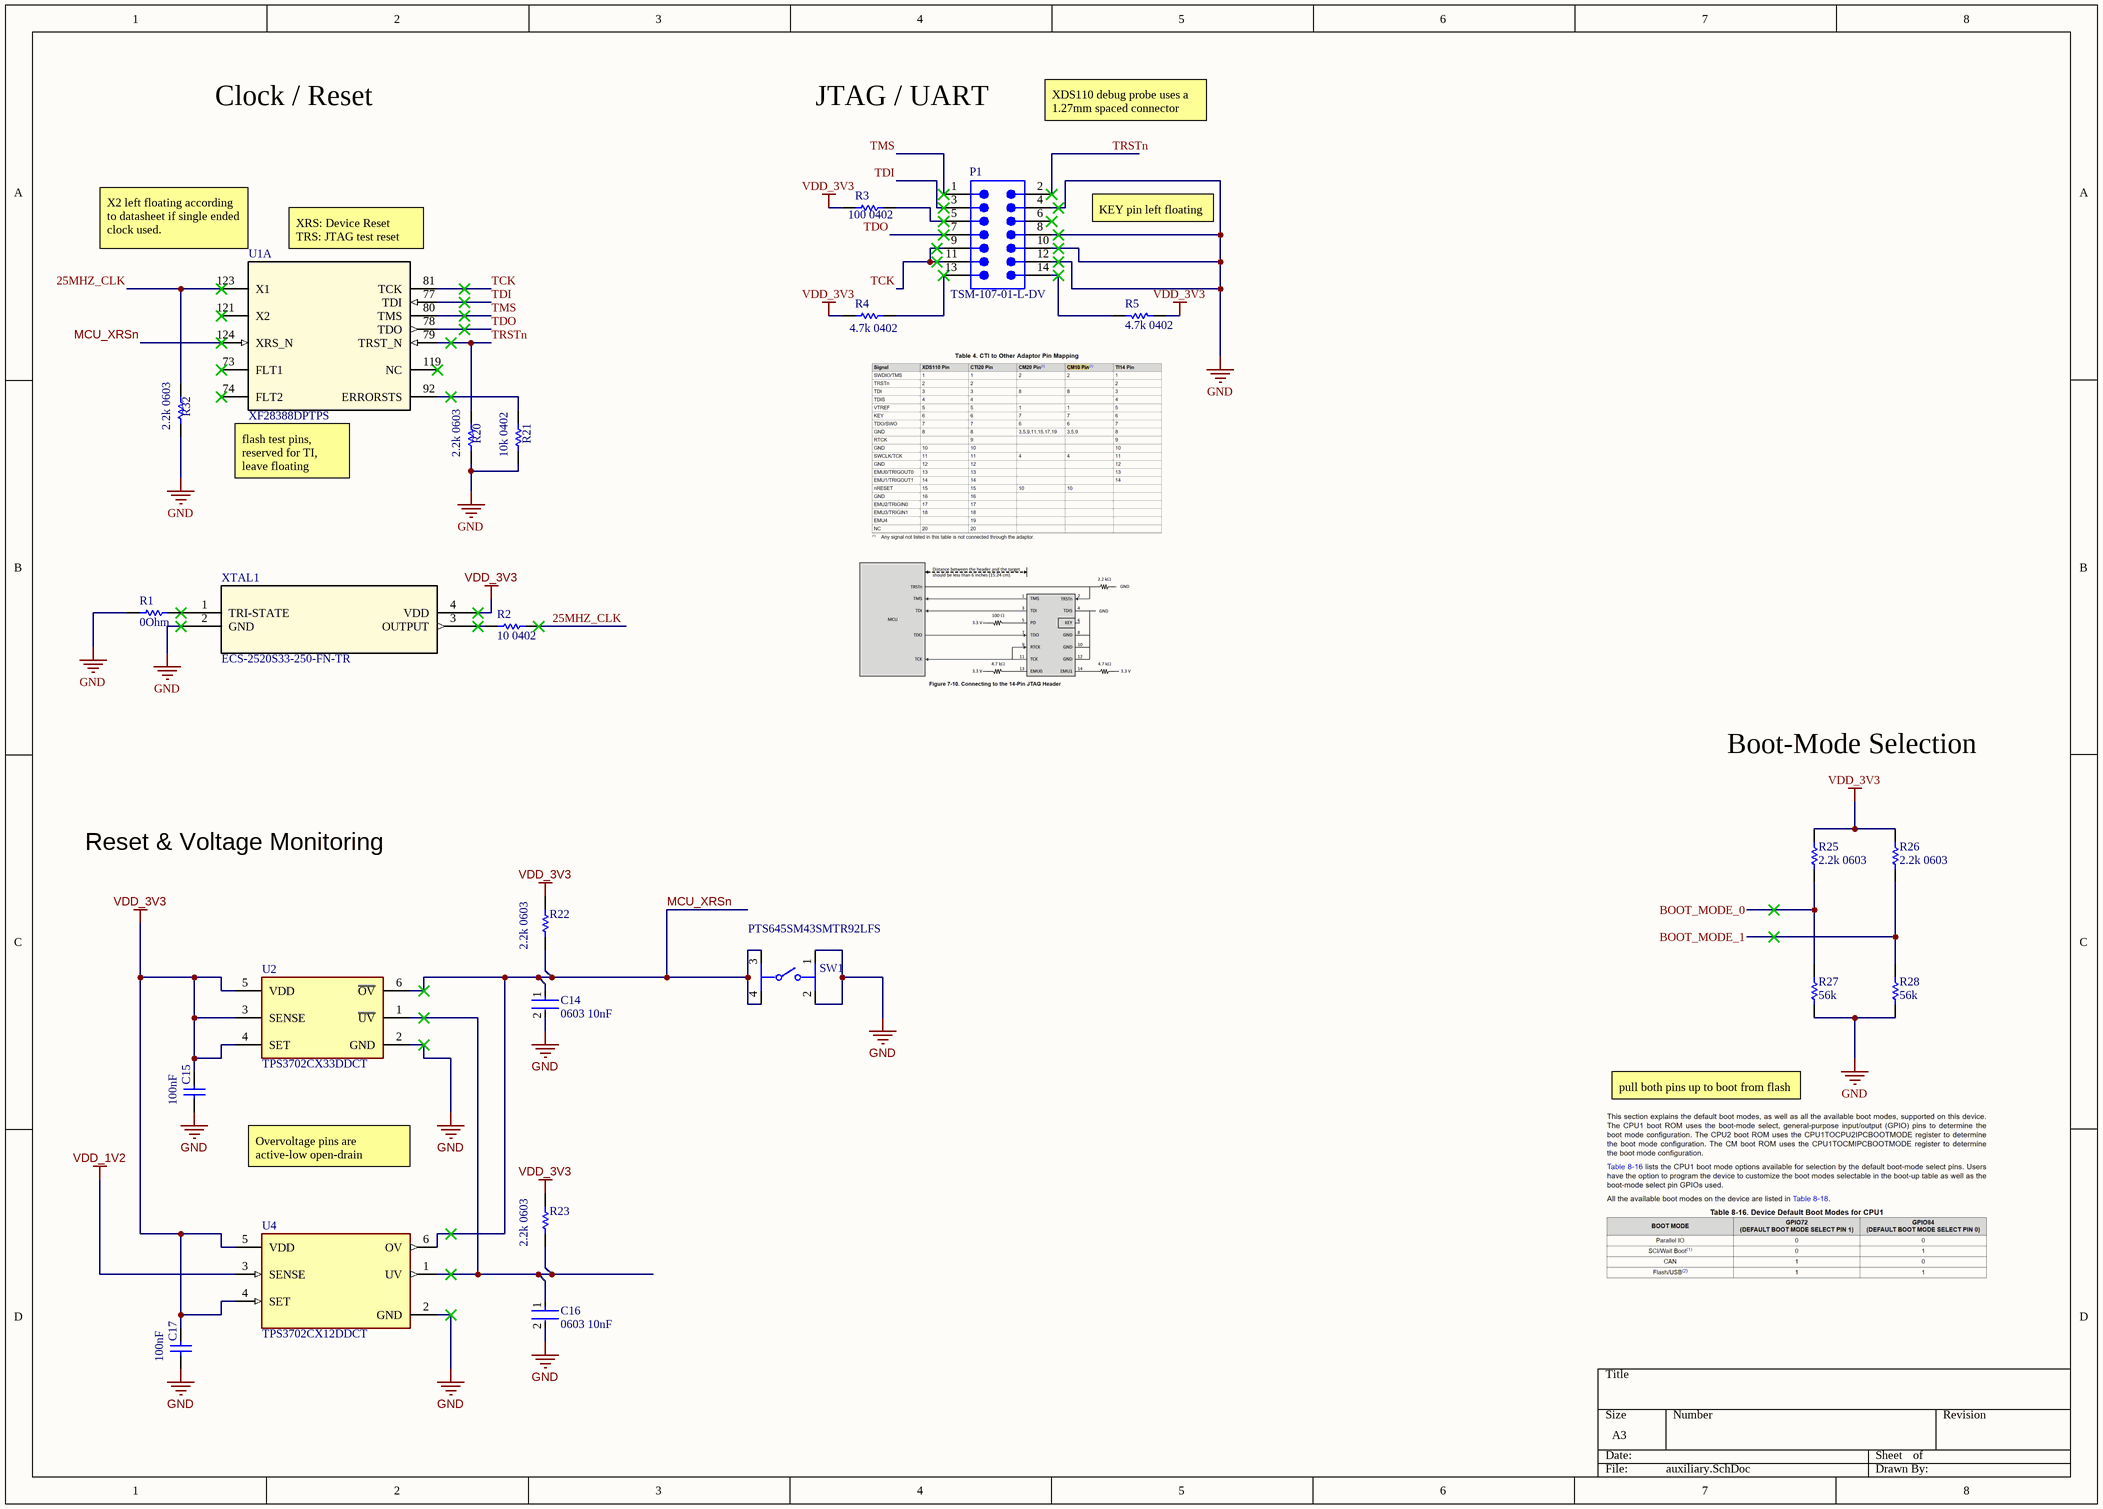
[diagram p2: auxiliary.SchDoc]

### Parts
C14  0603 10nF  [FP-CC0603-DA-MFG]
C15  100nF  [CAP 0402_1005]
C16  0603 10nF  [FP-CC0603-DA-MFG]
C17  100nF  [CAP 0402_1005]
P1  TSM-107-01-L-DV  [SMTC-TSM-107-01-X-DV]
R1  0Ohm  [RES 0603_1608]
R2  10 0402  [RES 0402_1005]
R3  100 0402  [RES 0603_1608]
R4  4.7k 0402  [RES 0603_1608]
R5  4.7k 0402  [RES 0603_1608]
R20  2.2k 0603  [RES 0603_1608]
R21  10k 0402  [RES 0402_1005]
R22  2.2k 0603  [RES 0603_1608]
R23  2.2k 0603  [RES 0603_1608]
R25  2.2k 0603  [RES 0603_1608]
R26  2.2k 0603  [RES 0603_1608]
R27  56k  [RES 0603_1608]
R28  56k  [RES 0603_1608]
R32  2.2k 0603  [RES 0603_1608]
SW1  PTS645SM43SMTR92LFS  [FP-PTS645SM43SMTR92LFS-MFG]
U1  XF28388DPTPS  [PTP0176F-IPC_A]  (part A of 5)
U2  TPS3702CX33DDCT  [FP-DDC0006A-IPC_B]
U4  TPS3702CX12DDCT  [FP-DDC0006A-IPC_C]
XTAL1  ECS-2520S33-250-FN-TR  [ECS-2520S_ECS]

### Nets
GND: C14.2 C15.1 C16.2 C17.1 P1.4 P1.8 P1.10 P1.12 R1.1 R20.1 R21.1 R27.1 R28.1 R32.1 SW1.1 SW1.2 U2.2(GND) U4.2(GND) XTAL1.2(GND)  [project net AGND]
VDD_1V2: U4.3(SENSE)
VDD_3V3: C15.2 C17.2 R3.2 R4.2 R5.2 R22.2 R23.2 R25.2 R26.2 U2.3(SENSE) U2.4(SET) U2.5(VDD) U4.4(SET) U4.5(VDD) XTAL1.4(VDD)
25MHZ_CLK: R2.1 R32.2 U1.123(X1)
BOOT_MODE_0: R25.1 R27.2
BOOT_MODE_1: R26.1 R28.2
MCU_XRSn: C14.1 R22.1 SW1.3 SW1.4 U1.124(XRS_N) U2.6(~{OV}) U4.6(OV)
TCK: P1.9 P1.11 U1.81(TCK)
TDI: P1.3 U1.77(TDI)
TDO: P1.7 U1.78(TDO)
TMS: P1.1 U1.80(TMS)
TRSTn: P1.2 R20.2 U1.79(TRST_N)
NetC16_1: C16.1 R23.1 U2.1(~{UV}) U4.1(UV)
NetP1_5: P1.5 R3.1
NetP1_13: P1.13 R4.1
NetP1_14: P1.14 R5.1
NetR1_2: R1.2 XTAL1.1(TRI-STATE)
NetR2_2: R2.2 XTAL1.3(OUTPUT)
NetR21_2: R21.2 U1.92(ERRORSTS)

Not connected (* = marked no-connect by the designer): P1 6*; U1 73(FLT1)* 74(FLT2)* 119(NC)* 121(X2)*

### Notes on the sheet
- Clock / Reset
- JTAG / UART
- XDS110 debug probe uses a 1.27mm spaced connector
- (near U1) X2 left floating according to datasheet if single ended clock used.
- (near U1) XRS: Device Reset
  TRS: JTAG test reset
- KEY pin left floating
- (near U1) flash test pins, reserved for TI, leave floating
- Boot-Mode Selection
- Reset & Voltage Monitoring
- pull both pins up to boot from flash
- Overvoltage pins are active-low open-drain

### Library data of the parts
C14 C16 = CMP-2100-03600-2: CAP CER 10000PF 50V X7R 0603 / CC0603KRX7R9BB103; Manufacturer: YAGEO; Tolerance: 0.1; Material: Ceramic; Temperature Coefficient: 15%; Mouser Description: Multilayer Ceramic Capacitor, CC Series, 0.01 - F, - 10%, X7R, 50 V, 0603 [1608 Metric]; Digikey Description: CAP CER 10000PF 50V X7R 0603; Height: 0.9mm; Category: Cap; Temperature Characteristic: X7R; Footprint Url: http://www.yageo.com/exep/pages/download/literatures/UPY-C_GEN_24.pdf; Lead Free: Yes; Voltage Rating: 50 V; Manufacturer Part Number: CC0603KRX7R9BB103; Temperature: -55°C to +125°C; Device Class L3: Ceramic Capacitors; ComponentLink2Description: Datasheet; Voltage: 50 V; Package: CC0603-DA; Octopart: https://octopart.com/cc0603krx7r9bb103-yageo-192938; Automotive: No; Temperature Range High: +125°C; Temperature Range Low: -55°C; Value: 10 nF; RoHS: TRUE; Device Class L1: Passive Components; ComponentLink2URL: http://www.yageo.com/documents/recent/UPY-GPHC_X7R_6.3V-to-50V_18.pdf; Device Class L2: Capacitors; Capacitance: 10 nF
C15 C17 = Cap: MLCC 100nF 0402 10V; Published: 8-Jun-2000; LatestRevisionDate: 17-Jul-2002; LatestRevisionNote: Re-released for DXP Platform.; PackageReference: RAD-0.3; Publisher: Altium Limited; PackageDescription: Radial Cap, Thru-Hole; 2 Leads; 0.3 in Pin Spacing; Value: 100nF; Supplier 1: Arrow Electronics; Supplier Part Number 1: C0402C104K8PACTU
P1 = CMP-1024-00260-1: 0.025" SQ Post Header, Surface Mount, Vertical, -55 to 125 degC, 2.54 mm Pitch, 14-Pin, Male, RoHS; Manufacturer: Samtec; Pitch: 2.54 mm; RoHS: True; PackageVersion: DJ, 4/1991; ComponentLink1Description: Manufacturer URL; ComponentLink3URL: http://www.samtec.com/documents/webfiles/cpdf/TSM-1XX-XX-XXX-XX-X-XXX-X-MKT.pdf; ComponentLink2Description: Datasheet; Orientation: Vertical; Mounting Technology: Surface Mount; ComponentLink2URL: http://www.samtec.com/documents/webfiles/pdf/TSM.PDF; PackageDescription: Double Row Gullwing ASM; DatasheetVersion: F-214; PackageReference: TSM-107-01-X-DV; ComponentLink1URL: http://www.samtec.com; ComponentLink3Description: Package Specification; PartNumber: TSM-107-01-L-DV; Temperature Range: -55 to 125 degC
R1 = Res1: Resistor 0Ohm 0603; Value: 22k; Published: 8-Jun-2000; LatestRevisionDate: 17-Jul-2002; LatestRevisionNote: Re-released for DXP Platform.; PackageReference: AXIAL-0.3; Publisher: Altium Limited; PackageDescription: Axial Device, Thru-Hole; 2 Leads; 0.3 in Pin Spacing; Supplier 1: Future Electronics; Supplier Part Number 1: 3375797
R2 = Res1: Resistor 10Ohm 0402; Value: 2.2k; Published: 8-Jun-2000; LatestRevisionDate: 17-Jul-2002; LatestRevisionNote: Re-released for DXP Platform.; PackageReference: AXIAL-0.3; Publisher: Altium Limited; PackageDescription: Axial Device, Thru-Hole; 2 Leads; 0.3 in Pin Spacing; Supplier 1: Arrow Electronics; Supplier Part Number 1: ERJ-2RKF10R0X
R3 = Res1: Resistor 100Ohm 0402; Value: 100; Published: 8-Jun-2000; LatestRevisionDate: 17-Jul-2002; LatestRevisionNote: Re-released for DXP Platform.; PackageReference: AXIAL-0.3; Publisher: Altium Limited; PackageDescription: Axial Device, Thru-Hole; 2 Leads; 0.3 in Pin Spacing; Supplier 1: Arrow Electronics; Supplier Part Number 1: ERJ-2RKF1000X
R4 R5 = Res1: Resistor 4.7kOhm 0402; Published: 8-Jun-2000; LatestRevisionDate: 17-Jul-2002; LatestRevisionNote: Re-released for DXP Platform.; PackageReference: AXIAL-0.3; Publisher: Altium Limited; PackageDescription: Axial Device, Thru-Hole; 2 Leads; 0.3 in Pin Spacing; Value: 4.7k
R20 R22 R23 R25 R26 R32 = Res1: Resistor 2.2kOhm 0603; Published: 8-Jun-2000; LatestRevisionDate: 17-Jul-2002; LatestRevisionNote: Re-released for DXP Platform.; PackageReference: AXIAL-0.3; Publisher: Altium Limited; PackageDescription: Axial Device, Thru-Hole; 2 Leads; 0.3 in Pin Spacing; Value: 2.2k
R21 = Res1: Resistor 10kOhm 0402; Published: 8-Jun-2000; LatestRevisionDate: 17-Jul-2002; LatestRevisionNote: Re-released for DXP Platform.; PackageReference: AXIAL-0.3; Publisher: Altium Limited; PackageDescription: Axial Device, Thru-Hole; 2 Leads; 0.3 in Pin Spacing; Value: 10k
R27 R28 = Res1: Resistor 56kOhm 0603; Published: 8-Jun-2000; LatestRevisionDate: 17-Jul-2002; LatestRevisionNote: Re-released for DXP Platform.; PackageReference: AXIAL-0.3; Publisher: Altium Limited; PackageDescription: Axial Device, Thru-Hole; 2 Leads; 0.3 in Pin Spacing; Value: 56k
SW1 = CMP-2000-05160-2: SWITCH TACTILE SPST-NO 0.05A 12V; Contact Resistance: 100mR; Throw Configuration: SPST; Illumination Type: Non-Illuminated; Mechanical Life: 100000Cycles; Current Rating: 50mA; Switch Function: Off-Mom; Actuator Length: 0.85mm; Actuator Material: Nylon; Actuator Type: Standard; Operating Force: 160gf; Min Operating Temperature: -20°C; REACH SVHC: No SVHC; Termination: Gull Wing; Case/Package: SMD/SMT; Packaging: Tape and Reel; Mount: Surface Mount; Voltage Rating (DC): 12V; Orientation: Straight; Lead Free: Lead Free; Contact Material: Silver; Color: Black; Max Current Rating: 50mA; Contact Plating: Silver; Depth: 9mm; Package Quantity: 1; Max Voltage Rating (DC): 12V; Length: 6mm; Max Operating Temperature: 60°C
U1 = XF28388DPTPS: Mfr_Name: Texas Instruments; TYPE: TYPE; RefDes: RefDes; Supplier 1: Mouser; Supplier Part Number 1: 595-F28388DPTPS
U2 = CMP-04919-000019-1: IC SUPERVISOR 1 CHANNEL TSOT23-6; Operating Supply Current: 7uA; Quiescent Current: 6uA; Max Supply Voltage: 18V; Min Supply Voltage: 2V; Threshold Voltage: 3.3V; Undervoltage Threshold: 3.17V; Overvoltage Threshold: 3.6V; Number of Monitored Inputs: 1; Reset: Active Low; Accuracy: 0.25%; Package Quantity: 250; Weight: 0.001058oz; RoHS Compliant: Yes; Type: Voltage Detector; REACH SVHC: No SVHC; Number of Pins: 6; Min Operating Temperature: -40°C; Lead Free: Lead Free; Mount: Surface Mount; Case/Package: SOT-6; Max Operating Temperature: 125°C; Number of Voltages Monitored: 1; Packaging: Tape and Reel
U4 = CMP-04919-000022-1: IC SUPERVISOR 1 CHANNEL TSOT23-6; Reset: Active Low; Quiescent Current: 6uA; Threshold Voltage: 1.2V; Number of Voltages Monitored: 1; Max Supply Voltage: 18V; Min Supply Voltage: 2V; Lead Free: Lead Free; Number of Pins: 6; Mount: Surface Mount; Case/Package: SOT-23-6; Type: Voltage Detector; Max Operating Temperature: 125°C; REACH SVHC: No SVHC; Min Operating Temperature: -40°C; Packaging: Cut Tape; RoHS Compliant: Yes
XTAL1 = ECS-2520S33-250-FN-TR: 25MHz Oscillator; Mfr_Name: ECS International; RefDes: RefDes; Type: Type; Supplier 1: Digikey; Supplier Part Number 1: XC2198CT-ND

## Sheet usb.SchDoc
size A4; SheetNumber: 4; SheetTotal: 6
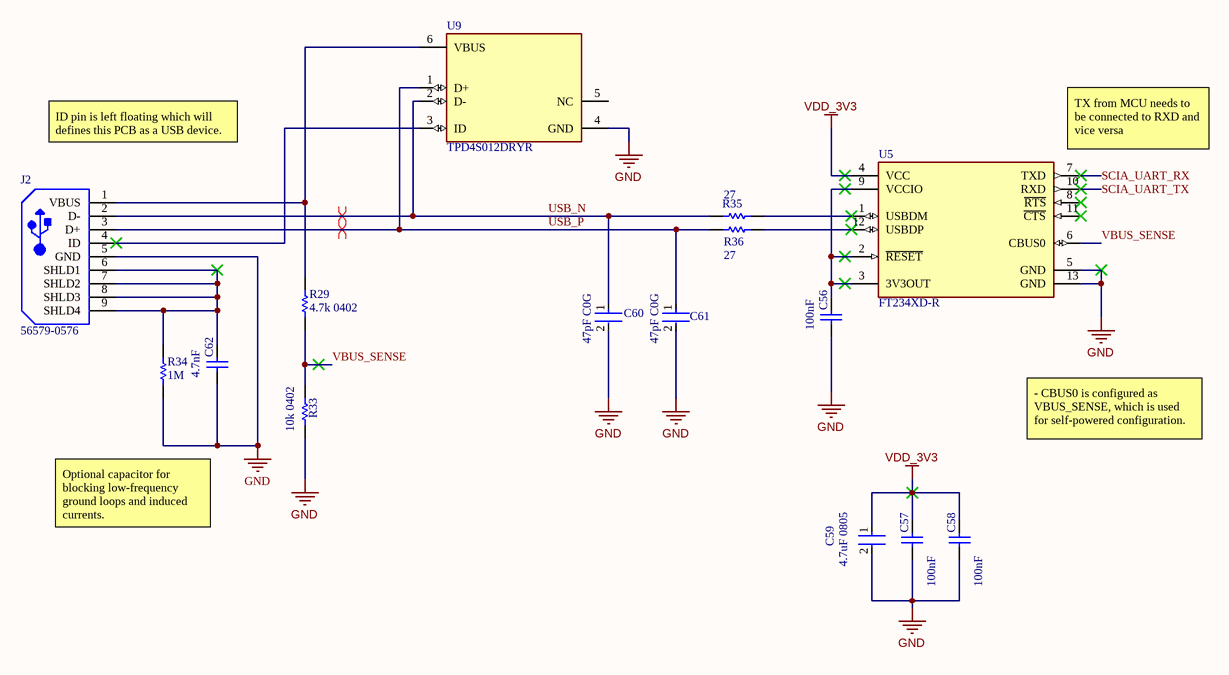
[diagram p3: usb.SchDoc]

### Parts
C56  100nF  [CAP 0402_1005]
C57  100nF  [CAP 0402_1005]
C58  100nF  [CAP 0402_1005]
C59  4.7uF 0805  [FP-C0805C475K8PACTU-MFG]
C60  47pF C0G  [FP-C0402-BB-MFG]
C61  47pF C0G  [FP-C0402-BB-MFG]
C62  4.7nF  [CAP 0603_1608]
J2  56579-0576  [MOLX-56579-0576_V]
R29  4.7k 0402  [RES 0402_1005 RF]
R33  10k 0402  [RES 0402_1005]
R34  1M  [RES 0402_1005]
R35  27  [RES 0402_1005]
R36  27  [RES 0402_1005]
U5  FT234XD-R  [FP-DFN-12-IPC_B]
U9  TPD4S012DRYR  [FP-DRY0006A-MFG]

### Nets
GND: C56.1 C57.1 C58.1 C59.2 C60.2 C61.2 C62.1 J2.5(GND) R33.1 R34.2 U5.5(GND) U5.13(GND) U9.4(GND)  [project net AGND]
VDD_3V3: C57.2 C58.2 C59.1 U5.4(VCC)
SCIA_UART_RX: U5.7(TXD)
SCIA_UART_TX: U5.10(RXD)
USB_N: C60.1 J2.2(D-) R35.1 U9.2(D-)
USB_P: C61.1 J2.3(D+) R36.1 U9.1(D+)
VBUS_SENSE: R29.2 R33.2 U5.6(CBUS0)
NetC56_2: C56.2 U5.2(~{RESET}) U5.3(3V3OUT) U5.9(VCCIO)
NetC62_2: C62.2 J2.6(SHLD1) J2.7(SHLD2) J2.8(SHLD3) J2.9(SHLD4) R34.1
NetJ2_1: J2.1(VBUS) R29.1 U9.6(VBUS)
NetJ2_4: J2.4(ID) U9.3(ID)
NetR35_2: R35.2 U5.1(USBDM)
NetR36_2: R36.2 U5.12(USBDP)

Not connected (* = marked no-connect by the designer): U5 8(~{RTS})* 11(~{CTS})*; U9 5(NC)

### Layout directives
differential pair: USB_N, USB_P

### Notes on the sheet
- ID pin is left floating which will defines this PCB as a USB device.
- (near U5) TX from MCU needs to be connected to RXD and vice versa
- - CBUS0 is configured as VBUS_SENSE, which is used for self-powered configuration.
- Optional capacitor for blocking low-frequency ground loops and induced currents.

### Library data of the parts
C56-C58 = Cap: MLCC 100nF 0402 10V; Published: 8-Jun-2000; LatestRevisionDate: 17-Jul-2002; LatestRevisionNote: Re-released for DXP Platform.; PackageReference: RAD-0.3; Publisher: Altium Limited; PackageDescription: Radial Cap, Thru-Hole; 2 Leads; 0.3 in Pin Spacing; Value: 100nF; Supplier 1: Arrow Electronics; Supplier Part Number 1: C0402C104K8PACTU
C59 = CMP-2007-01007-2: CAP CER 4.7UF 10V X5R 0805; Dielectric Material: Ceramic; Dissipation Factor: 5%; Tolerance: 10%; Lead Pitch: 0.75mm; Mount: Surface Mount; Voltage Rating (DC): 10V; Length: 2mm; Case Code (Imperial): 0805; Height: 1.25mm; Package Quantity: 1; Thickness: 0.055inch; Depth: 1.25mm; Case Code (Metric): 2012; Termination: SMD/SMT; Construction: Flat; Dielectric: X5R; Series: C; Capacitance: 4.7uF; Width: 1.2mm; Max Operating Temperature: 85°C; Packaging: Tape and Reel; Voltage Rating: 10V; REACH SVHC: No SVHC; Min Operating Temperature: -55°C; Number of Pins: 2; Case/Package: 0805; Radiation Hardening: No; Lead Free: Lead Free; Voltage: 10V; RoHS Compliant: Yes
C60 C61 = CMP-2008-03283-3: MLCC 47pF 0402 10V C0G; Voltage: 50V; Temperature Coefficient: 30ppm/°C; Dielectric Material: Ceramic; Tolerance: 5%; Length: 1mm; Height: 0.5mm; Lead Free: Lead Free; Lead Pitch: 0.3mm; Width: 0.02inch; Min Operating Temperature: -55°C; Case Code (Imperial): 0402; Package Quantity: 1; Contact Plating: Tin; Series: C; Depth: 0.5mm; Dielectric: C0G; Termination: SMD/SMT; REACH SVHC: No SVHC; Number of Pins: 2; Construction: Flat; RoHS Compliant: Yes; Capacitance: 47pF; Thickness: 0.022inch; Radiation Hardening: No; Case/Package: 0402; Voltage Rating (DC): 50V; Voltage Rating: 50V; Max Operating Temperature: 125°C; Packaging: Tape and Reel; Case Code (Metric): 1005; Mount: Surface Mount
C62 = Cap: MLCC 4.7nF 0603 10V; Published: 8-Jun-2000; LatestRevisionDate: 17-Jul-2002; LatestRevisionNote: Re-released for DXP Platform.; PackageReference: RAD-0.3; Publisher: Altium Limited; PackageDescription: Radial Cap, Thru-Hole; 2 Leads; 0.3 in Pin Spacing; Value: 4.7nF
J2 = CMP-2000-05643-1: USB Connector, 30 V, 1 A, 0 to 50 degC, 5-Pin SMD, RoHS, Tape and Reel; Brand: Molex; Insulation Resistance: 100MOhms; Connector Type: MiniUSBTypeABReceptacle; Mounting Angle: Right; Number of Ports: 1Port; Gender: Female; Voltage Rating: 30VAC/DC; Number of Contacts: 5Contact; Current Rating: 1A; Package Reference: 56579-0576; Package Description: 5-Pin Surface Mount Device, Body 9.9 x 9 mm, Pitch 0.8 mm; Color: Gray; Manufacturer URL: http://www.molex.com/; Product: MiniUSBTypeABConnectors; Factory Pack Quantity: 800; Standard: USB; Termination Style: SolderTab; Contact Plating: Gold; Product Category: USBConnectors; Datasheet Version: Rev. E, 04/2006; Operating Temperature Range: 0Cto+50C; RoHS: Details; Manufacturer: Molex; Features: MetalshieldingforESDprotection; Mounting Technology: SurfaceMount; Flammability Rating: UL94V-0; Datasheet URL: http://www.molex.com/pdm_docs/sd/565790576_sd.pdf; Series: 56579; Contact Material: CopperAlloy; Packaging: Reel
R29 = Res1: Resistor 4.7kOhm 0402; Published: 8-Jun-2000; LatestRevisionDate: 17-Jul-2002; LatestRevisionNote: Re-released for DXP Platform.; PackageReference: AXIAL-0.3; Publisher: Altium Limited; PackageDescription: Axial Device, Thru-Hole; 2 Leads; 0.3 in Pin Spacing; Value: 4.7k
R33 = Res1: Resistor 10kOhm 0402; Published: 8-Jun-2000; LatestRevisionDate: 17-Jul-2002; LatestRevisionNote: Re-released for DXP Platform.; PackageReference: AXIAL-0.3; Publisher: Altium Limited; PackageDescription: Axial Device, Thru-Hole; 2 Leads; 0.3 in Pin Spacing; Value: 10k
R34 = Res1: Resistor 1MOhm 0402; Published: 8-Jun-2000; LatestRevisionDate: 17-Jul-2002; LatestRevisionNote: Re-released for DXP Platform.; PackageReference: AXIAL-0.3; Publisher: Altium Limited; PackageDescription: Axial Device, Thru-Hole; 2 Leads; 0.3 in Pin Spacing; Value: 1M; Supplier 1: Arrow Electronics; Supplier Part Number 1: CRGCQ0402F1M0
R35 R36 = Res1: Resistor 27Ohm 0402; Published: 8-Jun-2000; LatestRevisionDate: 17-Jul-2002; LatestRevisionNote: Re-released for DXP Platform.; PackageReference: AXIAL-0.3; Publisher: Altium Limited; PackageDescription: Axial Device, Thru-Hole; 2 Leads; 0.3 in Pin Spacing; Value: 27; Supplier 1: Digikey; Supplier Part Number 1: YAG3086CT-ND
U5 = CMP-0248-00027-3: IC USB SERIAL BASIC UART 12DFN; Min Supply Voltage: 2.97V; Number of Ports: 1; Operating Supply Voltage: 5V; Operating Supply Current: 8mA; Max Supply Voltage: 5.5V; Data Rate: 3Mbps; Length: 3mm; Case/Package: DFN; Mount: Surface Mount; Packaging: Tape and Reel; Max Operating Temperature: 85°C; Height: 0.75mm; Number of Pins: 12; Number of Transceivers: 1; Package Quantity: 5000; Min Operating Temperature: -40°C; Width: 3mm; REACH SVHC: No SVHC; Interface: UART; Lead Free: Lead Free
U9 = CMP-0326-00038-4: TVS DIODE 5.5V 6SON; Breakdown Voltage: 24V; Interface: USB; ESD Protection: Yes; Peak Pulse Power: 60W; Number of Circuits: 4; Polarity: Unidirectional; Capacitance: 15pF; Test Current: 1mA; Working Voltage: 19V; Min Breakdown Voltage: 6V; Peak Pulse Current: 3A; Operating Supply Voltage: 950mV; Max Operating Temperature: 85°C; Packaging: Tape and Reel; Termination: SMD/SMT; Number of Pins: 6; Radiation Hardening: No; Width: 1.05mm; REACH SVHC: No SVHC; Lead Free: Lead Free; Depth: 1mm; Package Quantity: 5000; Length: 1.45mm; Direction: Unidirectional; Min Operating Temperature: -40°C; Number of Channels: 4; Max Power Dissipation: 60W; Height: 0.55mm